# EAGLE design relays (EAGLE 6.6.0)
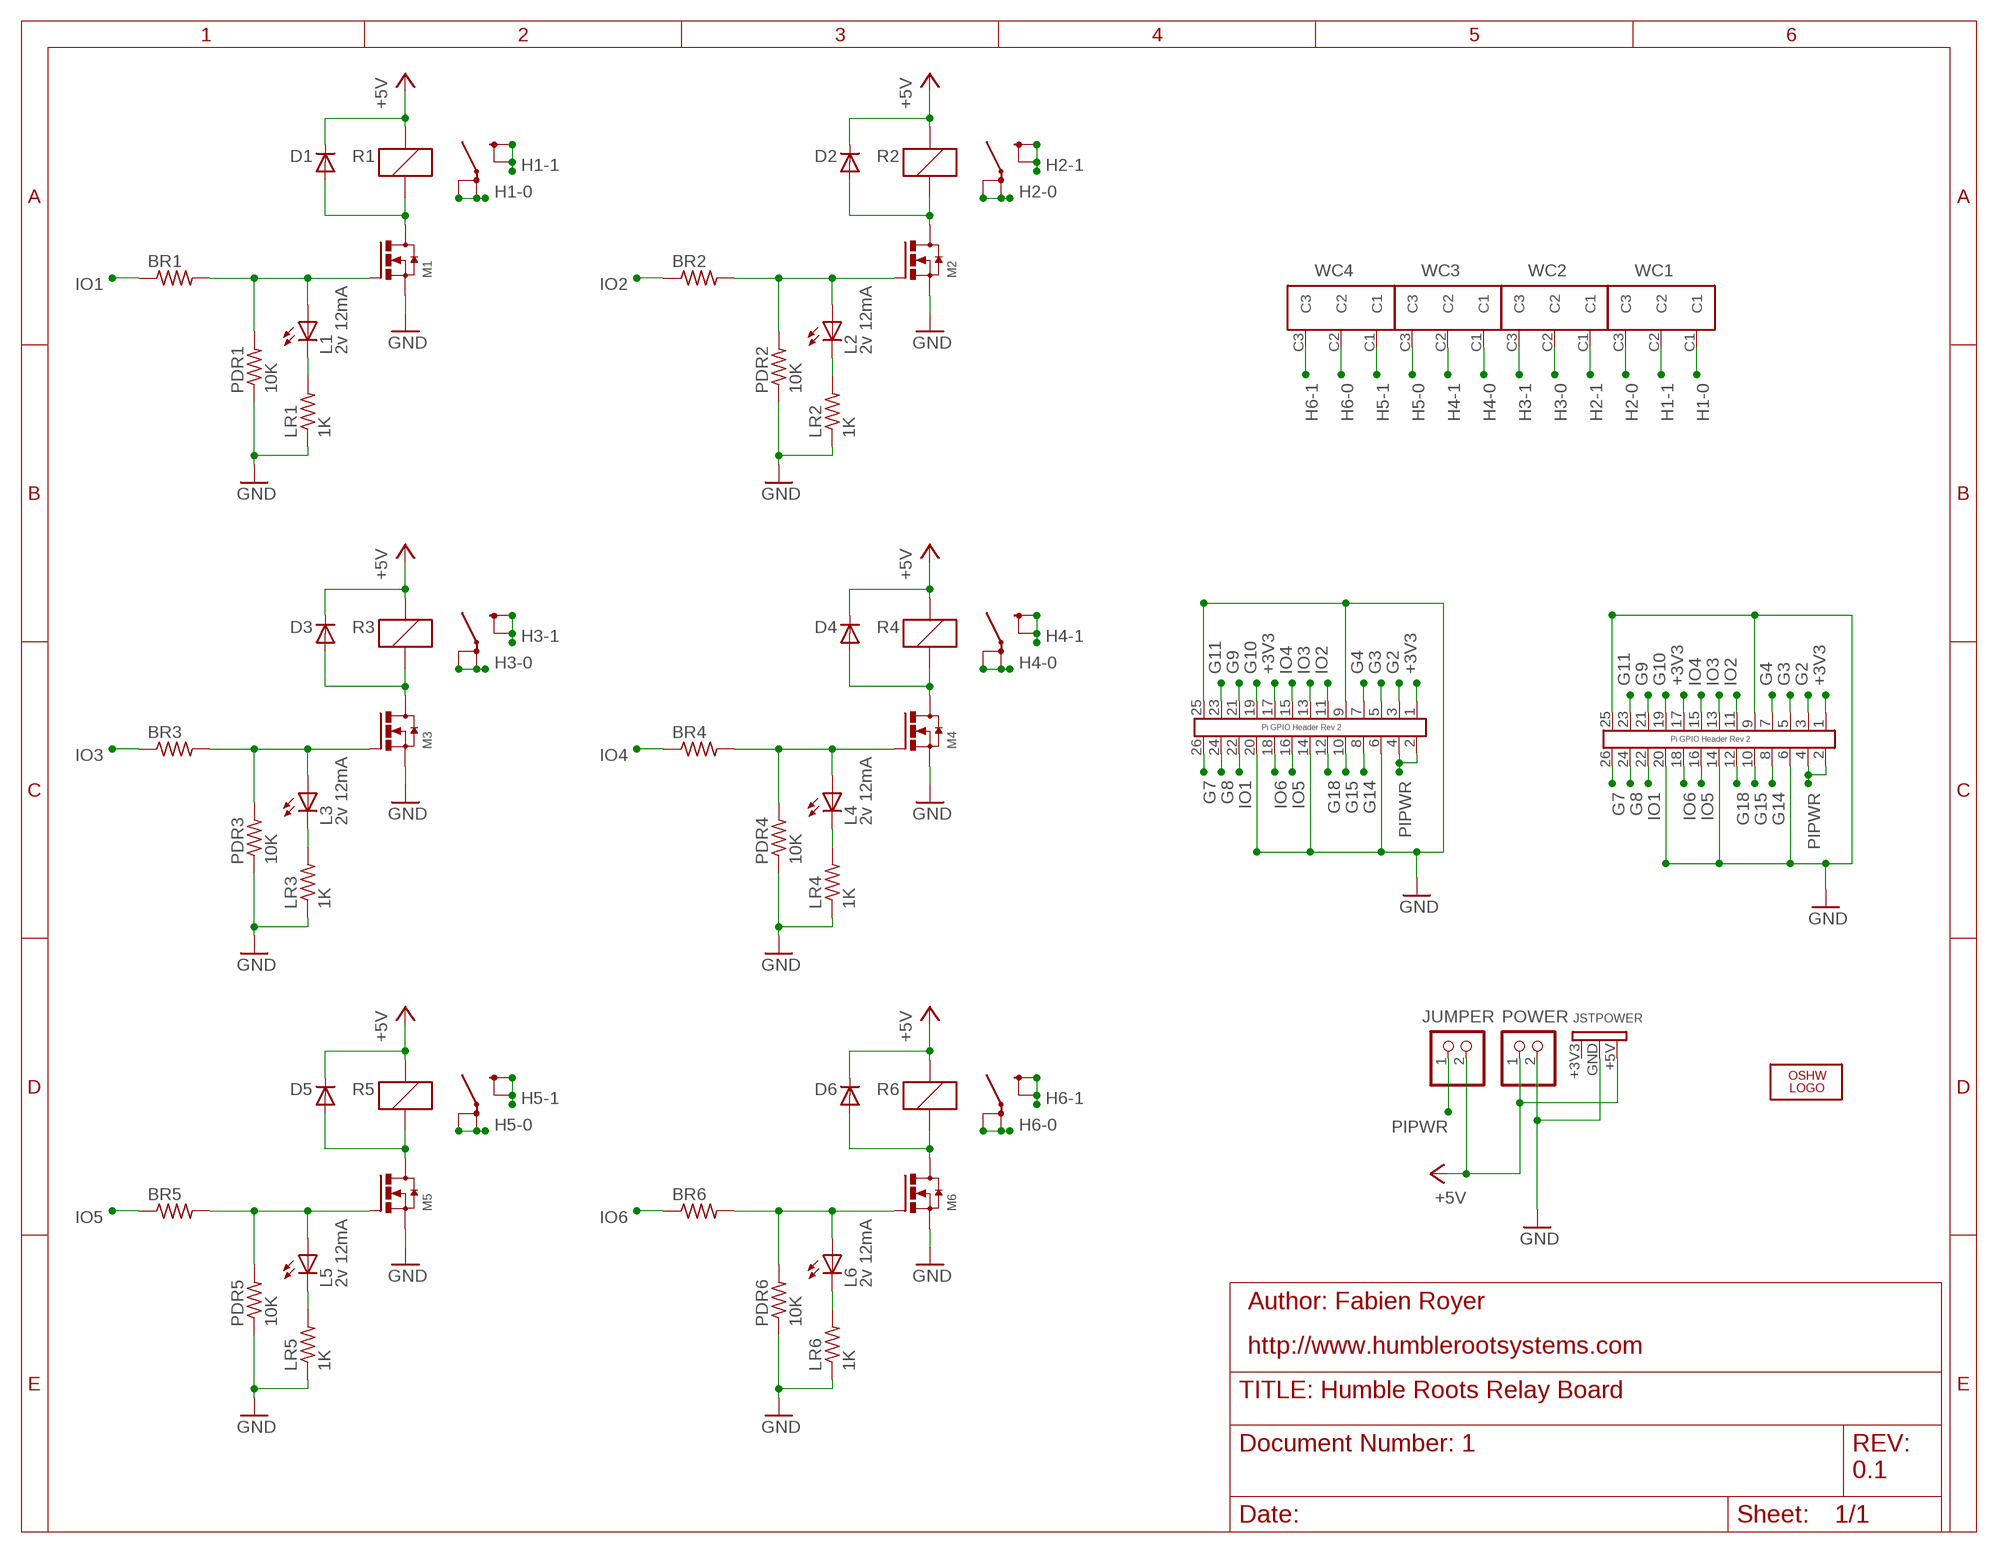
[diagram p0: schematic, sheet 1]

## Parts
BR1  R-US_0207/10  [0207/10]
BR2  R-US_0207/10  [0207/10]
BR3  R-US_0207/10  [0207/10]
BR4  R-US_0207/10  [0207/10]
BR5  R-US_0207/10  [0207/10]
BR6  R-US_0207/10  [0207/10]
D1  1N4004  [DO41-10]
D2  1N4004  [DO41-10]
D3  1N4004  [DO41-10]
D4  1N4004  [DO41-10]
D5  1N4004  [DO41-10]
D6  1N4004  [DO41-10]
JSTPOWER  JST_PH_3_POSITIONS_TOP_ENTRY_THROUGH_HOLE  [JST_PH_3_POSITIONS_TOP_ENTRY_THROUGH_HOLE]
JUMPER  5V  PINHD-1X2  [1X02]
L1  2v 12mA  LED3MM  [LED3MM]
L2  2v 12mA  LED3MM  [LED3MM]
L3  2v 12mA  LED3MM  [LED3MM]
L4  2v 12mA  LED3MM  [LED3MM]
L5  2v 12mA  LED3MM  [LED3MM]
L6  2v 12mA  LED3MM  [LED3MM]
LOGO1  OSHW_LOGO_6MILX0200-NT  [OSHW_6X200_NOTEXT]
LR1  1K  R-US_0207/10  [0207/10]
LR2  1K  R-US_0207/10  [0207/10]
LR3  1K  R-US_0207/10  [0207/10]
LR4  1K  R-US_0207/10  [0207/10]
LR5  1K  R-US_0207/10  [0207/10]
LR6  1K  R-US_0207/10  [0207/10]
M1  FAIRCHILD_2N700X_N-CHANNEL_MOSFET_TO92  [FAIRCHILD_2N700X_TO92]
M2  FAIRCHILD_2N700X_N-CHANNEL_MOSFET_TO92  [FAIRCHILD_2N700X_TO92]
M3  FAIRCHILD_2N700X_N-CHANNEL_MOSFET_TO92  [FAIRCHILD_2N700X_TO92]
M4  FAIRCHILD_2N700X_N-CHANNEL_MOSFET_TO92  [FAIRCHILD_2N700X_TO92]
M5  FAIRCHILD_2N700X_N-CHANNEL_MOSFET_TO92  [FAIRCHILD_2N700X_TO92]
M6  FAIRCHILD_2N700X_N-CHANNEL_MOSFET_TO92  [FAIRCHILD_2N700X_TO92]
PDR1  10K  R-US_0207/10  [0207/10]
PDR2  10K  R-US_0207/10  [0207/10]
PDR3  10K  R-US_0207/10  [0207/10]
PDR4  10K  R-US_0207/10  [0207/10]
PDR5  10K  R-US_0207/10  [0207/10]
PDR6  10K  R-US_0207/10  [0207/10]
POWER  5V  PINHD-1X2  [1X02]
R1  SCHRACK_POWER_PCB_RELAY_RZ_16A_NO  [SCHRACK_POWER_PCB_RELAY_RZ_16A]
R2  SCHRACK_POWER_PCB_RELAY_RZ_16A_NO  [SCHRACK_POWER_PCB_RELAY_RZ_16A]
R3  SCHRACK_POWER_PCB_RELAY_RZ_16A_NO  [SCHRACK_POWER_PCB_RELAY_RZ_16A]
R4  SCHRACK_POWER_PCB_RELAY_RZ_16A_NO  [SCHRACK_POWER_PCB_RELAY_RZ_16A]
R5  SCHRACK_POWER_PCB_RELAY_RZ_16A_NO  [SCHRACK_POWER_PCB_RELAY_RZ_16A]
R6  SCHRACK_POWER_PCB_RELAY_RZ_16A_NO  [SCHRACK_POWER_PCB_RELAY_RZ_16A]
U$5  PI_GPIO_13X2_PIN_HEADER  [PIN_HEADER_13X2_POSITIONS_DIL]
U$6  PI_GPIO_13X2_PIN_HEADER  [PIN_HEADER_13X2_POSITIONS_DIL]
WC1  PHOENIX_WIRE_CONTACT_3_POSITIONS_GENERIC  [PHOENIX_WIRE_CONTACT_3_POSITIONS_GENERIC]
WC2  PHOENIX_WIRE_CONTACT_3_POSITIONS_GENERIC  [PHOENIX_WIRE_CONTACT_3_POSITIONS_GENERIC]
WC3  PHOENIX_WIRE_CONTACT_3_POSITIONS_GENERIC  [PHOENIX_WIRE_CONTACT_3_POSITIONS_GENERIC]
WC4  PHOENIX_WIRE_CONTACT_3_POSITIONS_GENERIC  [PHOENIX_WIRE_CONTACT_3_POSITIONS_GENERIC]

## Nets
+3V3: U$5.1(P1_3V3) U$5.17(P17_3V3) U$6.1(P1_3V3) U$6.17(P17_3V3)
+5V: D1.C D2.C D3.C D4.C D5.C D6.C JSTPOWER.+5V JUMPER.2 POWER.1 R1.COIL_A1 R2.COIL_A1 R3.COIL_A1 R4.COIL_A1 R5.COIL_A1 R6.COIL_A1
G2: U$5.3(P3_GPIO2_SDA) U$6.3(P3_GPIO2_SDA)
G3: U$5.5(P5_GPIO3_SCL) U$6.5(P5_GPIO3_SCL)
G4: U$5.7(P7_GPIO4) U$6.7(P7_GPIO4)
G7: U$5.26(P26_GPIO7_SPI0_CE1) U$6.26(P26_GPIO7_SPI0_CE1)
G8: U$5.24(P24_GPIO8_SPI0_CE0) U$6.24(P24_GPIO8_SPI0_CE0)
G9: U$5.21(P21_GPIO9_SPI0_MISO) U$6.21(P21_GPIO9_SPI0_MISO)
G10: U$5.19(P19_GPIO10_SPI0_MOSI) U$6.19(P19_GPIO10_SPI0_MOSI)
G11: U$5.23(P23_GPIO11_SPI0_SCLK) U$6.23(P23_GPIO11_SPI0_SCLK)
G14: U$5.8(P8_GPIO14_UART0_TXD) U$6.8(P8_GPIO14_UART0_TXD)
G15: U$5.10(P10_GPIO15_UART0_RXD) U$6.10(P10_GPIO15_UART0_RXD)
G18: U$5.12(P12_GPIO18) U$6.12(P12_GPIO18)
GND: JSTPOWER.GND LR1.1 LR2.1 LR3.1 LR4.1 LR5.1 LR6.1 M1.S(SOURCE) M2.S(SOURCE) M3.S(SOURCE) M4.S(SOURCE) M5.S(SOURCE) M6.S(SOURCE) PDR1.1 PDR2.1 PDR3.1 PDR4.1 PDR5.1 PDR6.1 POWER.2 U$5.6(P6_GND) U$5.9(P9_GND) U$5.14(P14_GND) U$5.20(P20_GND) U$5.25(P25_GND) U$6.6(P6_GND) U$6.9(P9_GND) U$6.14(P14_GND) U$6.20(P20_GND) U$6.25(P25_GND)
H1-0: R1.11A_LOAD R1.11B_LOAD WC1.C1
H1-1: R1.14A_LOAD R1.14B_LOAD WC1.C2
H2-0: R2.11A_LOAD R2.11B_LOAD WC1.C3
H2-1: R2.14A_LOAD R2.14B_LOAD WC2.C1
H3-0: R3.11A_LOAD R3.11B_LOAD WC2.C2
H3-1: R3.14A_LOAD R3.14B_LOAD WC2.C3
H4-0: R4.11A_LOAD R4.11B_LOAD WC3.C1
H4-1: R4.14A_LOAD R4.14B_LOAD WC3.C2
H5-0: R5.11A_LOAD R5.11B_LOAD WC3.C3
H5-1: R5.14A_LOAD R5.14B_LOAD WC4.C1
H6-0: R6.11A_LOAD R6.11B_LOAD WC4.C2
H6-1: R6.14A_LOAD R6.14B_LOAD WC4.C3
IO1: BR1.1 U$5.22(P22_GPIO25) U$6.22(P22_GPIO25)
IO2: BR2.1 U$5.11(P11_GPIO17) U$6.11(P11_GPIO17)
IO3: BR3.1 U$5.13(P13_GPIO27) U$6.13(P13_GPIO27)
IO4: BR4.1 U$5.15(P15_GPIO22) U$6.15(P15_GPIO22)
IO5: BR5.1 U$5.16(P16_GPIO23) U$6.16(P16_GPIO23)
IO6: BR6.1 U$5.18(P18_GPIO24) U$6.18(P18_GPIO24)
N$1: L1.K(C) LR1.2
N$2: BR2.2 L2.A M2.G(GATE) PDR2.2
N$3: L2.K(C) LR2.2
N$5: D1.A M1.D(DRAIN) R1.COIL_A2
N$6: D2.A M2.D(DRAIN) R2.COIL_A2
N$7: BR1.2 L1.A M1.G(GATE) PDR1.2
N$8: BR3.2 L3.A M3.G(GATE) PDR3.2
N$9: L3.K(C) LR3.2
N$10: D3.A M3.D(DRAIN) R3.COIL_A2
N$11: BR4.2 L4.A M4.G(GATE) PDR4.2
N$12: L4.K(C) LR4.2
N$13: D4.A M4.D(DRAIN) R4.COIL_A2
N$14: BR5.2 L5.A M5.G(GATE) PDR5.2
N$15: L5.K(C) LR5.2
N$17: D5.A M5.D(DRAIN) R5.COIL_A2
N$18: BR6.2 L6.A M6.G(GATE) PDR6.2
N$19: L6.K(C) LR6.2
N$20: D6.A M6.D(DRAIN) R6.COIL_A2
PIPWR: JUMPER.1 U$5.2(P2_5V) U$5.4(P4_5V) U$6.2(P2_5V) U$6.4(P4_5V)
Unconnected: JSTPOWER.+3V3

## Notes on the sheet
- Author: Fabien Royer
- http://www.humblerootsystems.com
- 0.1

## Library data of the parts
BR1-BR6 LR1-LR6 PDR1-PDR6 = resistor:R-US_: RESISTOR, American symbol
D1-D6 = diode:1N4004: DIODE general purpose rectifier, 1 A
JSTPOWER = HRS:JST_PH_3_POSITIONS_TOP_ENTRY_THROUGH_HOLE
JUMPER POWER = pinhead:PINHD-1X2: PIN HEADER
L1-L6 = led:LED: LED OSRAM: - CHIPLED LG R971, LG N971, LY N971, LG Q971, LY Q971, LO R971, LY R971 LH N974, LH R974 LS Q976, LO Q976, LY Q976 LO Q996 - Hyper CHIPLED LW Q18S LB Q993, LB Q99A, LB R99A - SideLED LS A670, LO A670, LY A670, LG A670, LP A670 LB A673, LV A673, LT A673, LW A673 LH A674 LY A675 LS A676, LA A676, LO A676, LY A676, LW A676 LS A679, LY A679, LG A679 - Hyper Micro SIDELED® LS Y876, LA Y876, LO Y876, LY Y876 LT Y87S - SmartLED LW L88C, LW L88S LB L89C, LB L89S, LG L890 LS L89K, LO L89K, LY L89K LS L896, LA L896, LO L896, LY L896 - TOPLED LS T670, LO T670, LY T670, LG T670, LP T670 LSG T670, LSP T670, LSY T670, LOP T670, LYG T670 LG T671, LOG T671, LSG T671 LB T673, LV T673, LT T673, LW T673 LH T674 LS T676, LA T676, LO T676, LY T676, LB T676, LH T676, LSB T676, LW T676 LB T67C, LV T67C, LT T67C, LS T67K, LO T67K, LY T67K, LW E67C LS E67B, LA E67B, LO E67B, LY E67B, LB E67C, LV E67C, LT E67C LW T67C LS T679, LY T679, LG T679 LS T770, LO T770, LY T770, LG T770, LP T770 LB T773, LV T773, LT T773, LW T773 LH T774 LS E675, LA E675, LY E675, LS T675 LS T776, LA T776, LO T776, LY T776, LB T776 LHGB T686 LT T68C, LB T68C - Hyper Mini TOPLED® LB M676 - Mini TOPLED Santana® LG M470 LS M47K, LO M47K, LY M47K Source: http://www.osram.convergy.de LUXEON: - LUMILED® LXK2-PW12-R00, LXK2-PW12-S00, LXK2-PW14-U00, LXK2-PW14-V00 LXK2-PM12-R00, LXK2-PM12-S00, LXK2-PM14-U00 LXK2-PE12-Q00, LXK2-PE12-R00, LXK2-PE12-S00, LXK2-PE14-T00, LXK2-PE14-U00 LXK2-PB12-K00, LXK2-PB12-L00, LXK2-PB12-M00, LXK2-PB14-N00, LXK2-PB14-P00, LXK2-PB14-Q00 LXK2-PR12-L00, LXK2-PR12-M00, LXK2-PR14-Q00, LXK2-PR14-R00 LXK2-PD12-Q00, LXK2-PD12-R00, LXK2-PD12-S00 LXK2-PH12-R00, LXK2-PH12-S00 LXK2-PL12-P00, LXK2-PL12-Q00, LXK2-PL12-R00 Source: www.luxeon.com KINGBRIGHT: KA-3528ASYC Source: www.kingbright.com
LOGO1 = ohw-logo:OSHW_LOGO_6MIL
M1-M6 = HRS:FAIRCHILD_2N700X_N-CHANNEL_MOSFET_TO92
R1-R6 = HRS:SCHRACK_POWER_PCB_RELAY_RZ_16A_NO
U$5 U$6 = HRS:PI_GPIO_13X2_PIN_HEADER
WC1-WC4 = HRS:PHOENIX_WIRE_CONTACT_3_POSITIONS_GENERIC

## Board
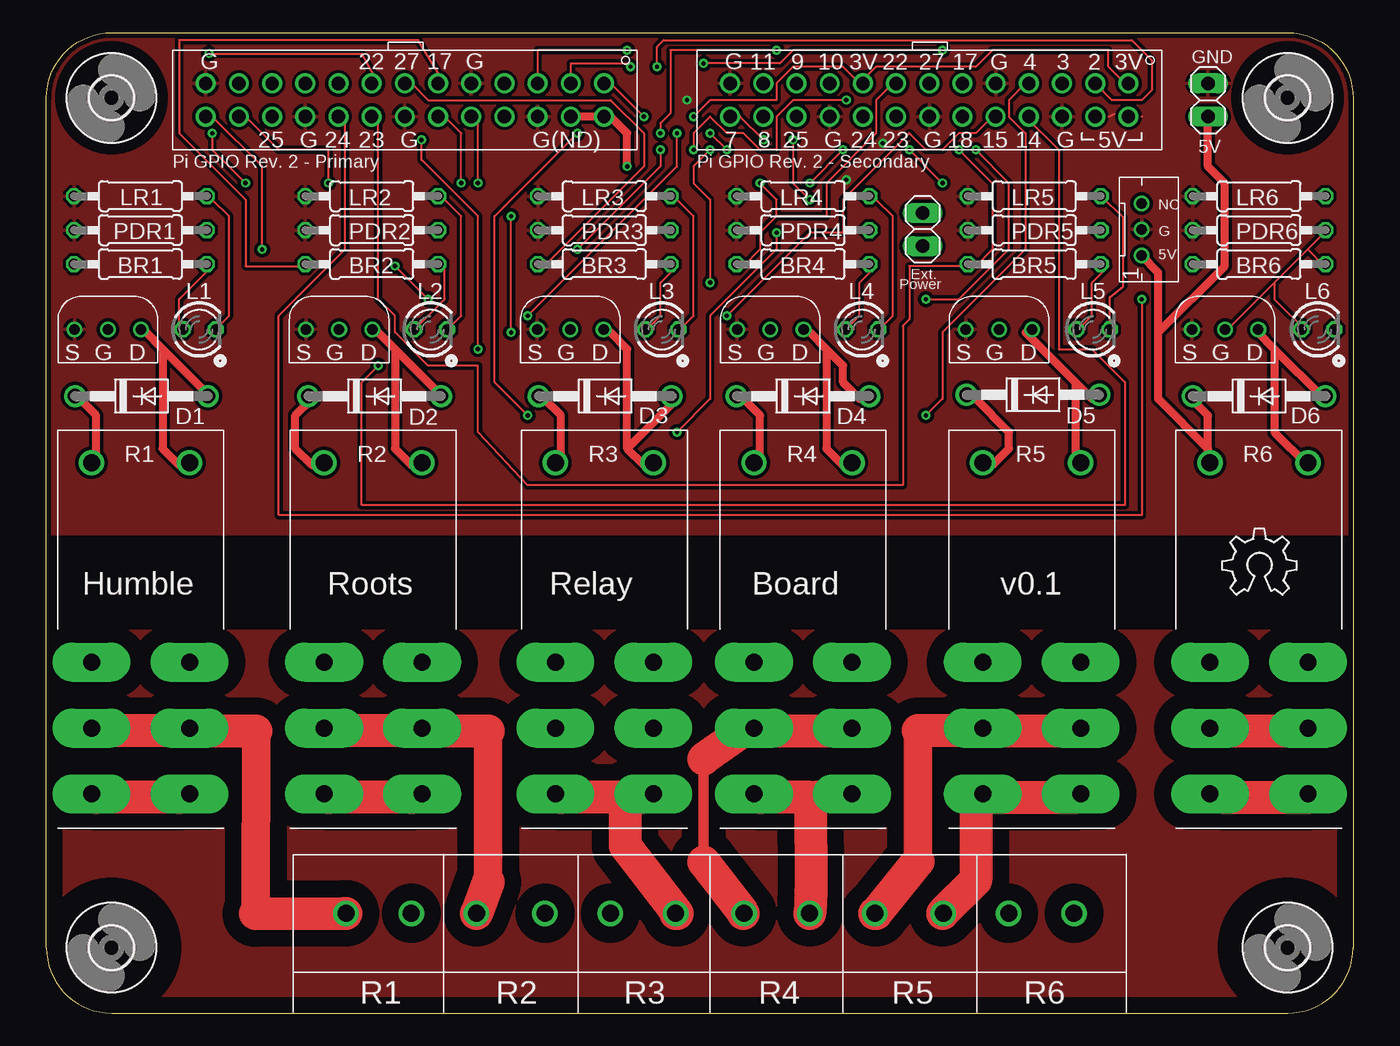
[diagram p1: board, top side]
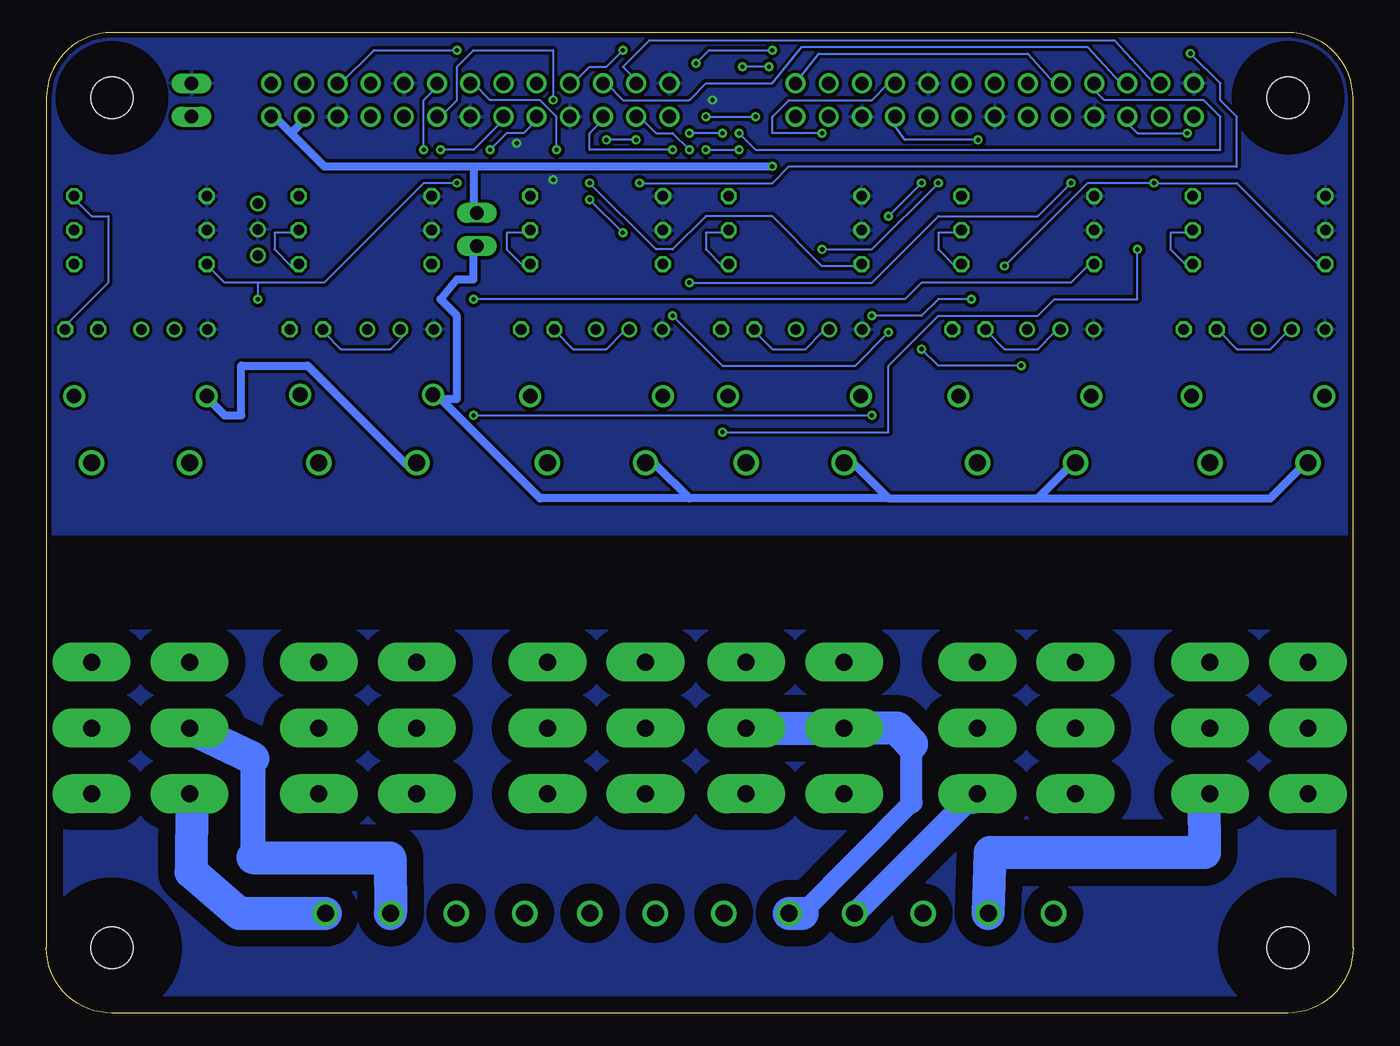
[diagram p2: board, bottom side, seen from below]

Size 100 x 75 mm. Coordinates in mm from the lower left corner, seen from the top.
Outline: 5,75 95,75 arc-90 100,70 100,5 arc-90 95,0 5,0 arc-90 0,5 0,70 arc-90 5,75
Copper layers (1*16): Top 0.0356mm / dielectric 1.5011mm / Bottom 0.0356mm
Design rules "LaenPCBOrder": minimum track width 6mil, minimum drill 13mil, track to track 6mil, track to pad 6mil, pad to pad 6mil, via to via 6mil, smd to smd 6mil, copper to edge 15mil, drill to drill 6mil, minimum pad ring 7mil, minimum via ring 7mil, stop-mask expansion 4mil, vias tented up to drill 0mil, thermal gap 10mil

### Footprints (pad centres in the part's own frame; a part is rotated, then mirrored left to right if it is on the bottom)
0207/10 = drill 0.813 octagon: 1 -5.08,0; 2 5.08,0
DO41-10 = drill 1.118: A 5.08,0; C -5.08,0
JST_PH_3_POSITIONS_TOP_ENTRY_THROUGH_HOLE = drill 0.8: +3V3 -2,0; +5V 2,0; GND 0,0
1X02 = drill 1.016 long: 1 -1.27,0; 2 1.27,0
LED3MM = drill 0.813 octagon: A -1.27,0; K 1.27,0
FAIRCHILD_2N700X_TO92 = drill 0.8: D -2.54,0; G 0,0; S 2.54,0
SCHRACK_POWER_PCB_RELAY_RZ_16A = drill 1.3 pad 3 long: 11A_LOAD 0,3.75; 11B_LOAD 0,-3.75; 12A -5.04,3.75; 12B -5.04,-3.75; 14A_LOAD 5.04,3.75; 14B_LOAD 5.04,-3.75 | drill 1.3: COIL_A1 -20.3,-3.75; COIL_A2 -20.3,3.75
3,2 = hole 3.2: 0,0
PIN_HEADER_13X2_POSITIONS_DIL = drill 1.016: 1 15.24,2.54; 2 15.24,0; 3 12.7,2.54; 4 12.7,0; 5 10.16,2.54; 6 10.16,0; 7 7.62,2.54; 8 7.62,0; 9 5.08,2.54; 10 5.08,0; 11 2.54,2.54; 12 2.54,0; 13 0,2.54; 14 0,0; 15 -2.54,2.54; 16 -2.54,0; 17 -5.08,2.54; 18 -5.08,0; 19 -7.62,2.54; 20 -7.62,0; 21 -10.16,2.54; 22 -10.16,0; 23 -12.7,2.54; 24 -12.7,0; 25 -15.24,2.54; 26 -15.24,0
PHOENIX_WIRE_CONTACT_3_POSITIONS_GENERIC = drill 1.3: C1 -5,0; C2 0,0; C3 5,0

### Placement (x,y rotation side)
BR1  7.2,57.3 0 top
BR2  24.9,57.3 0 top
BR3  42.7,57.3 0 top
BR4  57.9,57.3 0 top
BR5  75.6,57.3 0 top
BR6  92.8,57.3 0 top
D1  7.28,47.2 0 top
D2  25.12,47.2 0 top
D3  42.76,47.2 0 top
D4  57.9,47.2 0 top
D5  75.5,47.3 0 top
D6  92.8,47.2 0 top
JSTPOWER  83.82,59.94 270 top
JUMPER  67.06,59.94 270 top
L1  11.7,52.3 0 top
L2  29.4,52.3 0 top
L3  47.1,52.3 0 top
L4  62.4,52.3 0 top
L5  80.1,52.3 0 top
L6  97.3,52.3 0 top
LOGO1  90,32 0 top
LR1  7.2,62.5 0 top
LR2  24.9,62.5 0 top
LR3  42.7,62.5 0 top
LR4  57.9,62.5 0 top
LR5  75.6,62.5 0 top
LR6  92.8,62.5 0 top
M1  4.7,52.3 180 top
M2  22.4,52.3 180 top
M3  40.1,52.3 180 top
M4  55.4,52.3 180 top
M5  72.9,52.3 180 top
M6  90.2,52.3 180 top
PDR1  7.2,59.9 0 top
PDR2  24.9,59.9 0 top
PDR3  42.7,59.9 0 top
PDR4  57.9,59.9 0 top
PDR5  75.6,59.9 0 top
PDR6  92.8,59.9 0 top
POWER  88.9,69.85 90 top
R1  7.2,21.8 270 top
R2  25,21.8 270 top
R3  42.7,21.8 270 top
R4  57.9,21.8 270 top
R5  75.4,21.8 270 top
R6  92.8,21.8 270 top
U$1  [3,2]  4.98,5.01 0 top
U$2  [3,2]  94.98,5.01 0 top
U$3  [3,2]  4.98,70.01 0 top
U$4  [3,2]  94.98,70.01 0 top
U$5  27.43,68.58 0 top
U$6  67.56,68.58 0 top
WC1  27.92,7.63 0 top
WC2  43.16,7.63 0 top
WC3  58.4,7.63 0 top
WC4  73.64,7.63 0 top

### Tracks (layer width: path | path; a pad name or v marks a point on that pad's centre or on a via)
+3V3  (via drill 0.33)
  Top 0.152: 62.23,71.12 63.5,72.39 71.12,72.39 72.39,73.66 81.28,73.66 81.28,72.39 82.55,71.12 U$6.1 | v45.72,68.58 43.18,71.12 U$5.1 | v49.53,68.58 50.8,69.85 55.88,69.85 55.88,71.12 57.15,72.39 60.96,72.39 62.23,71.12 | 62.23,71.12 U$6.17
  Bottom 0.152: U$5.17 22.86,71.12 24.89,73.41 40.89,73.41 U$5.1 43.18,71.12 | v49.53,68.58 v45.72,68.58
+5V
  Top 0.152: 87.63,46.99 D6.C | 88.9,41.91 R6.COIL_A1
  Top 0.61: D5.C 71.12,46.99 73.66,44.45 73.66,43.18 72.39,41.91 R5.COIL_A1 | 87.63,46.99 88.9,45.72 88.9,43.18 | 88.9,41.91 88.9,43.18 | D4.C 53.34,46.99 54.61,45.72 54.61,41.91 R4.COIL_A1 | D1.C 2.54,46.99 3.81,45.72 3.81,41.91 R1.COIL_A1 | D2.C 20.32,46.99 19.05,45.72 19.05,43.18 20.32,41.91 R2.COIL_A1 | D3.C 38.1,46.99 39.37,45.72 39.37,41.91 R3.COIL_A1 | 85.09,52.07 85.09,46.99 88.9,43.18 | 85.09,52.07 85.09,56.64 JSTPOWER.+5V | POWER.1 88.9,64.77 90.17,63.5 90.17,57.15 85.09,52.07
  Bottom 0.152: 87.63,46.99 D6.C
  Bottom 0.61: 87.63,46.99 86.36,45.72 85.09,45.72 85.09,49.53 80.01,49.53 72.39,41.91 R5.COIL_A1 | 24.13,39.37 21.59,41.91 R2.COIL_A1 | 35.56,39.37 24.13,39.37 | 35.56,39.37 38.1,41.91 R3.COIL_A1 | 24.13,39.37 6.35,39.37 3.81,41.91 R1.COIL_A1 | 50.8,39.37 53.34,41.91 R4.COIL_A1 | 35.56,39.37 50.8,39.37 | 69.85,46.99 62.23,39.37 50.8,39.37 | 69.85,46.99 D5.C | 69.85,46.99 68.58,46.99 68.58,53.34 69.85,54.61 68.58,56.13 67.31,56.13 67.31,58.42 JUMPER.2
G2  (via drill 0.33)
  Top 0.152: U$5.3 40.13,72.64 44.45,72.64 v44.7,72.39 | v46.74,72.39 46.74,73.91 47.24,74.42 83.06,74.42 84.58,72.9 84.58,70.61 83.82,69.85 81.53,69.85 U$6.3
  Bottom 0.152: v44.7,72.39 v46.74,72.39
G3  (via drill 0.33)
  Top 0.152: v44.45,73.66 37.59,73.66 U$5.5 | v50.29,72.64 56.13,72.64 57.15,73.66 v68.58,73.66
  Bottom 0.152: v50.29,72.64 49.28,73.66 v44.45,73.66 | v68.58,73.66 74.93,73.66 77.47,71.12 U$6.5
G4  (via drill 0.33)
  Top 0.152: v40.64,67.31 34.29,60.96 34.29,48.26 v36.83,45.72 | v67.31,45.72 68.58,46.99 68.58,52.07 74.93,58.42 74.93,67.31 73.66,68.58 73.66,69.85 74.93,71.12 U$6.7
  Bottom 0.152: v40.64,67.31 44.45,67.31 44.45,68.58 43.18,69.85 36.83,69.85 35.56,71.12 U$5.7 | v67.31,45.72 v36.83,45.72
G7  (via drill 0.33)
  Top 0.152: v16.51,58.42 16.51,64.77 12.7,68.58 U$5.26 | v48.26,44.45 50.8,46.99 50.8,53.34 55.88,58.42 v55.88,59.69 | v58.42,62.23 57.15,63.5 v57.15,66.8 | v54.86,66.8 53.09,68.58 U$6.26 52.07,68.58
  Bottom 0.152: v16.51,58.42 16.51,54.61 22.86,54.61 24.13,53.34 31.75,53.34 35.56,49.53 35.56,44.45 v48.26,44.45 | v58.42,62.23 v55.88,59.69 | v54.86,66.8 v57.15,66.8
G8  (via drill 0.33)
  Top 0.152: v21.59,63.5 21.59,66.04 17.78,66.04 15.24,68.58 U$5.24 | v50.8,55.88 50.8,62.23 49.53,63.5 49.53,64.77 v50.8,66.04
  Bottom 0.152: v21.59,63.5 24.13,60.96 31.75,60.96 36.83,55.88 v50.8,55.88 | v50.8,66.04 52.07,67.31 53.34,67.31 54.61,68.58 U$6.24
G9
  Bottom 0.152: U$5.21 17.78,71.12 20.32,73.91 42.16,73.91 44.45,71.12 49.53,71.12 50.8,69.85 55.88,69.85 57.15,71.12 U$6.21
G10  (via drill 0.33)
  Top 0.152: v46.99,67.31 46.99,68.07 47.75,68.83 47.75,73.66 v55.88,73.66
  Bottom 0.152: v46.99,67.31 45.72,66.04 10.16,66.04 10.16,68.58 11.43,69.85 19.05,69.85 20.32,71.12 U$5.19 | v55.88,73.66 57.15,72.39 58.42,72.39 59.69,71.12 U$6.19
G11
  Bottom 0.152: U$5.23 15.24,71.12 18.29,74.42 53.85,74.42 55.88,72.39 54.61,71.12 U$6.23
G14  (via drill 0.33)
  Top 0.152: v28.7,66.8 28.7,65.28 33.02,60.96 v33.02,50.8 | v25.4,49.53 24.13,48.26 24.13,38.86 82.55,38.86 82.55,48.26 80.01,50.8 77.47,50.8 77.47,66.04 74.93,68.58 U$6.8
  Bottom 0.152: v28.7,66.8 34.29,66.8 35.56,68.58 U$5.8 | v33.02,50.8 31.75,49.53 v25.4,49.53
G15  (via drill 0.33)
  Top 0.152: v33.02,63.5 33.02,68.58 U$5.10 | v35.56,52.07 v35.56,60.96 | v52.07,53.34 58.42,59.69 60.96,59.69 60.96,62.23 66.04,67.31 67.31,66.04 68.58,66.04 69.85,67.31 71.12,67.31 72.39,68.58 U$6.10
  Bottom 0.152: v35.56,60.96 v33.02,63.5 | v35.56,52.07 38.1,49.53 48.26,49.53 v52.07,53.34
G18  (via drill 0.33)
  Top 0.152: v31.75,63.5 31.75,67.31 30.48,68.58 U$5.12 | v40.64,58.42 46.99,64.77 v46.99,66.04 | v49.53,66.04 49.53,67.31 50.8,68.58 52.07,67.31 53.34,67.31 54.61,66.04 55.88,66.04 55.88,68.58 57.15,69.85 v61.21,69.85
  Bottom 0.152: v31.75,63.5 36.83,58.42 v40.64,58.42 | v49.53,66.04 v46.99,66.04 | v61.21,69.85 61.21,73.66 67.31,73.66 68.58,72.39 68.58,69.85 69.85,68.58 U$6.12
GND  (via drill 0.33)
  Top 0.152: 83.82,59.69 JSTPOWER.GND | 83.82,68.58 83.87,68.58 | 81.28,68.58 81.74,68.79
  other vias: 64.01,66.55 61.21,63.75 49.02,69.85
  pour Bottom (isolate 0.254): 5.1,75 95,75 arc-90 100,70 100,36.6 0,36.6 0,69.9 arc-90
  pour Top (isolate 0.254): 5.3,75 95,75 arc-90 100,70 100,36.6 0,36.6 0,69.9 arc-90 5.1,75
H1-0
  Top 2.184: 16.04,21.58 16,7.6
  Top 2.54: 16,7.6 22.86,7.62 WC1.C1 | 16.04,21.58 11.43,21.59 R1.11A_LOAD 10.16,21.59 3.81,21.59 R1.11B_LOAD
H1-1
  Top 2.54: R1.14B_LOAD 3.81,16.51 10.16,16.51 R1.14A_LOAD
  Bottom 0.152: 27.94,7.62 WC1.C2
  Bottom 2.54: 27.94,7.62 27.79,12.27 11.37,12.27 11.43,16.51 R1.14A_LOAD
H2-0
  Top 0.152: 29.21,21.59 R2.11A_LOAD
  Top 2.184: 33.82,21.58 33.82,10.02
  Top 2.54: 29.21,21.59 33.82,21.58 | 33.82,10.02 WC1.C3 | R2.11B_LOAD 21.59,21.59 27.94,21.59 R2.11A_LOAD
H2-1
  Top 2.54: R2.14B_LOAD 21.59,16.51 27.94,16.51 R2.14A_LOAD
  Bottom 0.152: 38.1,7.62 WC2.C1
  Bottom 1.676: 29.21,16.51 38.1,7.62
  Bottom 2.54: 29.21,16.51 R2.14A_LOAD
H3-0
  Bottom 1.422: 42.17,7.63 33.8,16.1
  Bottom 1.676: 33.8,16.1 33.8,20.6
  Bottom 2.54: WC2.C2 42.17,7.63 | 33.8,20.6 34.9,21.8 R3.11B_LOAD R3.11A_LOAD
H3-1
  Top 2.54: WC2.C3 48.26,7.62 44.29,12.79 44.29,16.41 R3.14A_LOAD 45.52,16.51 39.37,16.51 R3.14B_LOAD
H4-0
  Top 0.152: 54.61,21.59 R4.11B_LOAD
  Top 0.813: 50.3,19.45 50.3,11.56
  Top 1.27: 53.34,7.62 WC3.C1
  Top 2.54: 50.3,11.56 53.34,7.62 | 50.3,19.45 53.34,21.59 R4.11B_LOAD | 54.61,21.59 60.96,21.59 R4.11A_LOAD
H4-1
  Top 1.27: 58.42,7.62 WC3.C2
  Top 2.54: 58.42,7.62 58.5,9.3 58.46,16.51 | 58.46,16.51 54.61,16.51 R4.14B_LOAD | 58.46,16.51 R4.14A_LOAD
H5-0
  Top 1.27: 72.39,21.59 R5.11B_LOAD
  Top 2.184: 66.7,21.6 66.7,11.6
  Top 2.54: 66.7,11.6 63.5,7.62 WC3.C3 | 66.7,21.6 71.12,21.59 R5.11B_LOAD | 72.39,21.59 78.74,21.59 R5.11A_LOAD
H5-1
  Top 0.152: 68.58,7.62 WC4.C1
  Top 1.27: 72.39,16.51 R5.14B_LOAD
  Top 2.54: 68.58,7.62 71.12,10.16 71.12,16.51 R5.14B_LOAD | 72.39,16.51 78.74,16.51 R5.14A_LOAD
H6-0
  Top 2.54: R6.11A_LOAD 96.52,21.59 90.17,21.59 R6.11B_LOAD
  Bottom 0.152: 73.66,7.62 WC4.C2
  Bottom 1.93: 84.2,19.49 84.2,11.9
  Bottom 2.54: 73.66,7.62 73.71,11.87 84.2,11.9 | 84.2,19.49 R6.11B_LOAD
H6-1
  Top 0.152: 90.17,16.51 R6.14B_LOAD
  Top 2.54: 90.17,16.51 96.52,16.51 R6.14A_LOAD
  Bottom 1.27: 88.9,16.51 R6.14B_LOAD
  Bottom 2.54: 88.9,16.51 88.93,10.81 85.24,7.62 WC4.C3
IO1  (via drill 0.33)
  Top 0.152: v15.24,63.5 12.7,66.04 v12.7,67.31 | v50.8,67.31 v52.07,66.04 | v48.26,67.31 48.26,64.77 v36.83,53.34 | v26.67,57.15 v29.21,54.61
  Bottom 0.152: v12.7,67.31 16.51,67.31 17.78,68.58 U$5.22 | BR1.1 2.54,57.15 8.89,63.5 v15.24,63.5 20.32,63.5 v26.67,57.15 | v52.07,66.04 58.42,66.04 58.42,67.31 57.15,68.58 U$6.22 | v48.26,67.31 v50.8,67.31 | v36.83,53.34 33.02,53.34 31.75,54.61 v29.21,54.61
IO2  (via drill 0.33)
  Top 0.152: BR2.1 20.32,57.15 15.24,57.15 15.24,62.23 10.16,67.31 10.16,74.42 28.45,74.42 30.48,71.12 U$5.11 | v71.12,66.04 73.66,63.5 73.66,58.42 69.85,54.61 v67.31,54.61
  Bottom 0.152: v71.12,66.04 71.12,69.85 69.85,71.12 U$6.11 | v67.31,54.61 34.29,54.61 33.02,55.88 21.59,55.88 20.32,57.15 BR2.1
IO3  (via drill 0.33)
  Top 0.152: BR3.1 38.1,57.15 45.72,64.77 45.72,67.31 43.18,69.85 29.21,69.85 27.94,71.12 U$5.13 | v58.42,63.5 v60.96,66.04
  Bottom 0.152: v60.96,66.04 60.96,68.58 62.23,69.85 66.04,69.85 67.31,71.12 U$6.13 | v58.42,63.5 53.34,58.42 52.07,58.42 49.53,60.96 44.45,60.96 40.64,57.15 38.1,57.15 BR3.1
IO4  (via drill 0.33)
  Top 0.152: 55.88,60.96 54.61,59.69 54.61,58.42 53.34,57.15 BR4.1 | 55.88,60.96 59.69,60.96 59.69,63.5 63.5,67.31 63.5,69.85 64.77,71.12 U$6.15 | v12.45,73.41 24.13,73.41 25.4,71.12 U$5.15 | v54.61,63.5 55.88,62.23 55.88,60.96
  Bottom 0.152: v12.45,73.41 10.16,71.12 10.16,69.85 8.89,68.58 8.89,64.77 43.18,64.77 44.45,63.5 v54.61,63.5
IO5  (via drill 0.33)
  Top 0.152: v69.85,66.04 72.39,63.5 72.39,58.42 71.12,57.15 70.61,57.15 | 70.61,57.15 66.04,57.15 66.04,53.09 65.53,52.58 65.53,40.39 36.83,40.39 33.02,44.45 33.02,49.53 29.21,49.53 26.67,52.07 26.67,53.34 25.4,54.61 25.4,68.58 U$5.16 | 70.61,57.15 70.52,57.24 BR5.1
  Bottom 0.152: v69.85,66.04 67.31,66.04 64.77,68.58 U$6.16
IO6  (via drill 0.33)
  Top 0.152: v66.04,66.04 v68.58,63.5 | v83.82,54.61 83.82,38.1 17.78,38.1 17.78,53.34 22.86,58.42 22.86,68.58 U$5.18
  Bottom 0.152: 83.82,55.88 78.74,55.88 71.12,63.5 v68.58,63.5 | 83.82,55.88 86.36,55.88 87.63,57.15 BR6.1 | v66.04,66.04 64.77,67.31 63.5,67.31 62.23,68.58 U$6.18 | 83.82,55.88 v83.82,54.61
N$1
  Top 0.152: LR1.2 12.7,62.23 13.97,60.96 13.97,53.34 12.7,52.07 L1.K
N$2
  Top 0.152: BR2.2 30.48,57.15 30.48,54.61 27.94,52.07 L2.A
  Bottom 0.152: BR2.2 30.48,57.15 31.75,58.42 31.75,59.69 30.48,59.69 PDR2.2 | M2.G 22.86,52.07 24.13,50.8 26.67,50.8 27.94,52.07 L2.A
N$3
  Top 0.152: LR2.2 30.48,62.23 31.75,60.96 31.75,53.34 30.48,52.07 L2.K
N$4
  pour Bottom (isolate 1.27): 0,29.3 100,29.3 100,5 arc-90 95,0 93.9,0 5.1,0 arc-90 0,5.1
N$5
  Top 0.152: 12.7,46.99 D1.A
  Top 0.61: 12.7,46.99 8.89,50.8 | 8.89,50.8 7.62,52.07 M1.D | 8.89,50.8 8.89,43.18 10.16,41.91 R1.COIL_A2
N$6
  Top 0.152: 30.48,46.99 D2.A
  Top 0.61: 30.48,46.99 26.67,50.8 | 26.67,50.8 25.4,52.07 M2.D | 26.67,50.8 26.67,43.18 27.94,41.91 R2.COIL_A2
N$7
  Top 0.152: BR1.2 12.7,57.15 10.16,54.61 10.16,52.07 L1.A
  Bottom 0.152: BR1.2 12.7,57.15 13.97,58.42 13.97,59.69 12.7,59.69 PDR1.2 | M1.G 5.08,52.07 6.35,50.8 8.89,50.8 10.16,52.07 L1.A
N$8
  Top 0.152: BR3.2 48.26,57.15 46.99,55.88 46.99,53.34 45.72,52.07 L3.A
  Bottom 0.152: BR3.2 48.26,57.15 49.53,58.42 49.53,59.69 48.26,59.69 PDR3.2 | M3.G 40.64,52.07 41.91,50.8 44.45,50.8 45.72,52.07 L3.A
N$9
  Top 0.152: LR3.2 48.26,62.23 49.53,60.96 49.53,53.34 48.26,52.07 L3.K
N$10
  Top 0.61: 44.45,43.18 44.45,50.8 43.18,52.07 M3.D | 44.45,43.18 45.72,41.91 R3.COIL_A2 | 44.45,43.18 48.26,46.99 D3.A
N$11
  Top 0.152: BR4.2 63.5,57.15 62.23,55.88 62.23,53.34 60.96,52.07 L4.A
  Bottom 0.152: BR4.2 63.5,57.15 64.77,58.42 64.77,59.69 63.5,59.69 PDR4.2 | M4.G 55.88,52.07 57.15,50.8 59.69,50.8 60.96,52.07 L4.A
N$12
  Top 0.152: LR4.2 63.5,62.23 64.77,60.96 64.77,53.34 63.5,52.07 L4.K
N$13
  Top 0.61: 59.69,50.8 60.96,49.53 60.96,48.26 62.23,46.99 D4.A | 59.69,50.8 58.42,52.07 M4.D | 59.69,50.8 59.69,43.18 60.96,41.91 R4.COIL_A2
N$14
  Top 0.152: BR5.2 81.28,57.15 80.01,55.88 80.01,53.34 78.74,52.07 L5.A
  Bottom 0.152: BR5.2 81.28,57.15 82.55,58.42 82.55,59.69 81.28,59.69 PDR5.2 | M5.G 72.39,52.07 73.66,50.8 77.47,50.8 78.74,52.07 L5.A
N$15
  Top 0.152: L5.K 81.37,54.77 82.4,55.6 82.4,60.88 LR5.2
N$17
  Top 0.61: 78.74,48.26 80.01,46.99 D5.A | 78.74,48.26 74.93,52.07 M5.D | 78.74,48.26 78.74,41.91 R5.COIL_A2
N$18
  Top 0.152: 96.52,58.42 97.79,59.69 PDR6.2 | 96.52,58.42 93.98,55.88 | 93.98,55.88 90.17,52.07 M6.G | 93.98,55.88 93.98,54.61 96.52,52.07 L6.A | 96.52,58.42 97.79,57.15 BR6.2
N$19
  Bottom 0.152: L6.K 99.06,52.07 95.25,55.88 95.25,60.96 96.52,60.96 97.79,62.23 LR6.2
N$20
  Top 0.152: 92.71,52.07 M6.D | 97.79,46.99 D6.A | 96.52,41.91 R6.COIL_A2
  Top 0.61: 97.79,46.99 93.98,50.8 | 93.98,50.8 92.71,52.07 | 96.52,41.91 93.98,44.45 93.98,50.8
N$21
  pour Top (isolate 1.27): 0,29.3 100,29.3 100,5 arc-90 95,0 5.1,0 arc-90 0,5.1
PIPWR  (via drill 0.33)
  Top 0.61: U$5.4 U$5.2 43.18,68.58 44.45,67.31 v44.45,64.77
  Bottom 0.152: 80.01,68.58 U$6.4
  Bottom 0.61: 67.31,64.77 67.31,60.96 JUMPER.1 | 67.31,64.77 78.74,64.77 81.28,67.31 | 81.28,67.31 82.55,68.58 U$6.2 | 81.28,67.31 80.01,68.58 | 67.31,64.77 v44.45,64.77

### Text on the board
tPlace: G | 22 | 27 | 17 | G | G | 11 | 9 | 10 | 3V | 22 | 27 | 17 | G | 4 | 3 | 2 | 3V | 25 | G | 24 | 23 | G | G(ND) | 7 | 8 | 25 | G | 24 | 23 | G | 18 | 15 | 14 | G | 5V | R1 | R2 | R3 | R4 | R5 | R6
tNames: GND | 5V | Pi GPIO Rev. 2 - Primary | Pi GPIO Rev. 2 - Secondary | NC | G | 5V | Ext. | Power
_tsilk: Humble | Roots | Relay | Board | v0.1